# Altium schematic sheet ShutdownSafety.SchDoc
size A3
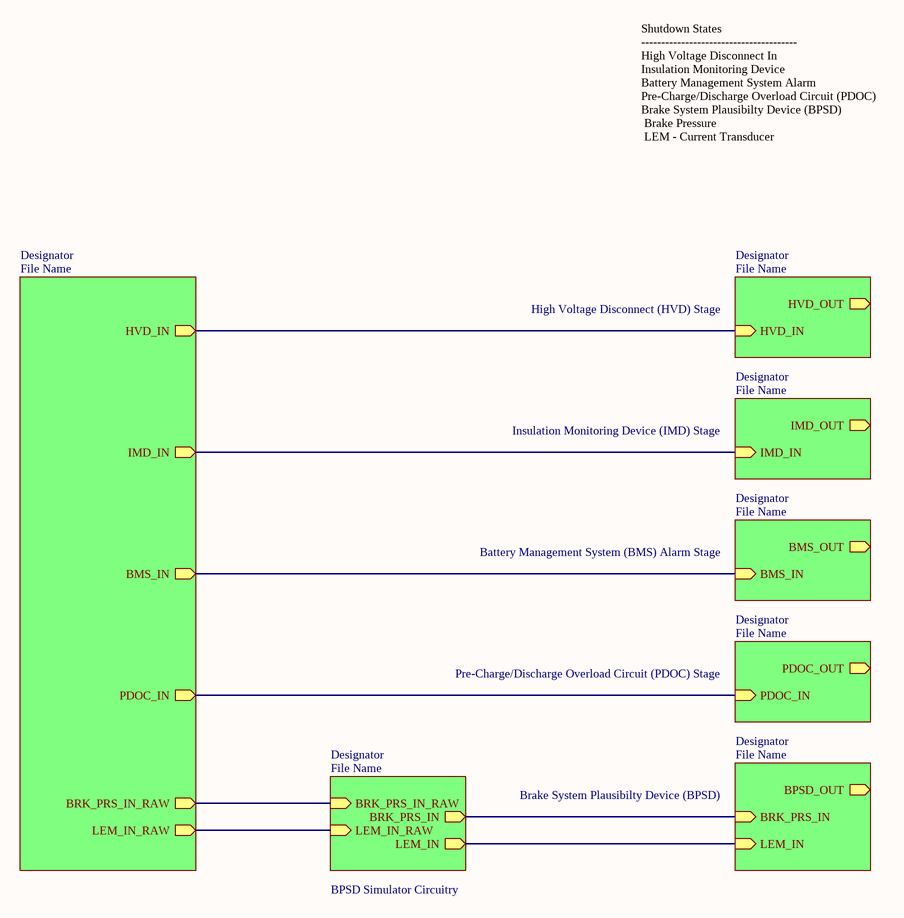
[diagram p0: ShutdownSafety.SchDoc]

## Sub-sheets
Designator = File Name: HVD_OUT (out), HVD_IN (in)
Designator = File Name: IMD_OUT (out), IMD_IN (in)
Designator = File Name: BMS_OUT (out), BMS_IN (in)
Designator = File Name: PDOC_OUT (out), PDOC_IN (in)
Designator = File Name: BPSD_OUT (out), BRK_PRS_IN (in), LEM_IN (in)
Designator = File Name: LEM_IN (out), BRK_PRS_IN (out), BRK_PRS_IN_RAW (in), LEM_IN_RAW (in)
Designator = File Name: LEM_IN_RAW (out), BRK_PRS_IN_RAW (out), PDOC_IN (out), BMS_IN (out), IMD_IN (out), HVD_IN (out)

## Nets
(unnamed): sheet Designator/HVD_IN, sheet Designator/HVD_IN
(unnamed): sheet Designator/IMD_IN, sheet Designator/IMD_IN
(unnamed): sheet Designator/BMS_IN, sheet Designator/BMS_IN
(unnamed): sheet Designator/PDOC_IN, sheet Designator/PDOC_IN
(unnamed): sheet Designator/BRK_PRS_IN, sheet Designator/BRK_PRS_IN
(unnamed): sheet Designator/LEM_IN, sheet Designator/LEM_IN
(unnamed): sheet Designator/BRK_PRS_IN_RAW, sheet Designator/BRK_PRS_IN_RAW
(unnamed): sheet Designator/LEM_IN_RAW, sheet Designator/LEM_IN_RAW

## Notes on the sheet
- Shutdown States
  ---------------------------------------
  High Voltage Disconnect In
  Insulation Monitoring Device
  Battery Management System Alarm
  Pre-Charge/Discharge Overload Circuit (PDOC)
  Brake System Plausibilty Device (BPSD)
  Brake Pressure
  LEM - Current Transducer
- High Voltage Disconnect (HVD) Stage
- Insulation Monitoring Device (IMD) Stage
- Battery Management System (BMS) Alarm Stage
- Pre-Charge/Discharge Overload Circuit (PDOC) Stage
- Brake System Plausibilty Device (BPSD)
- BPSD Simulator Circuitry
- Title
- Size:
- Date:
- A3
- Number:
- Time:
- Revision:
- Sheet
- of
- File: